# EAGLE design Power PCB (EAGLE 6.5.0)
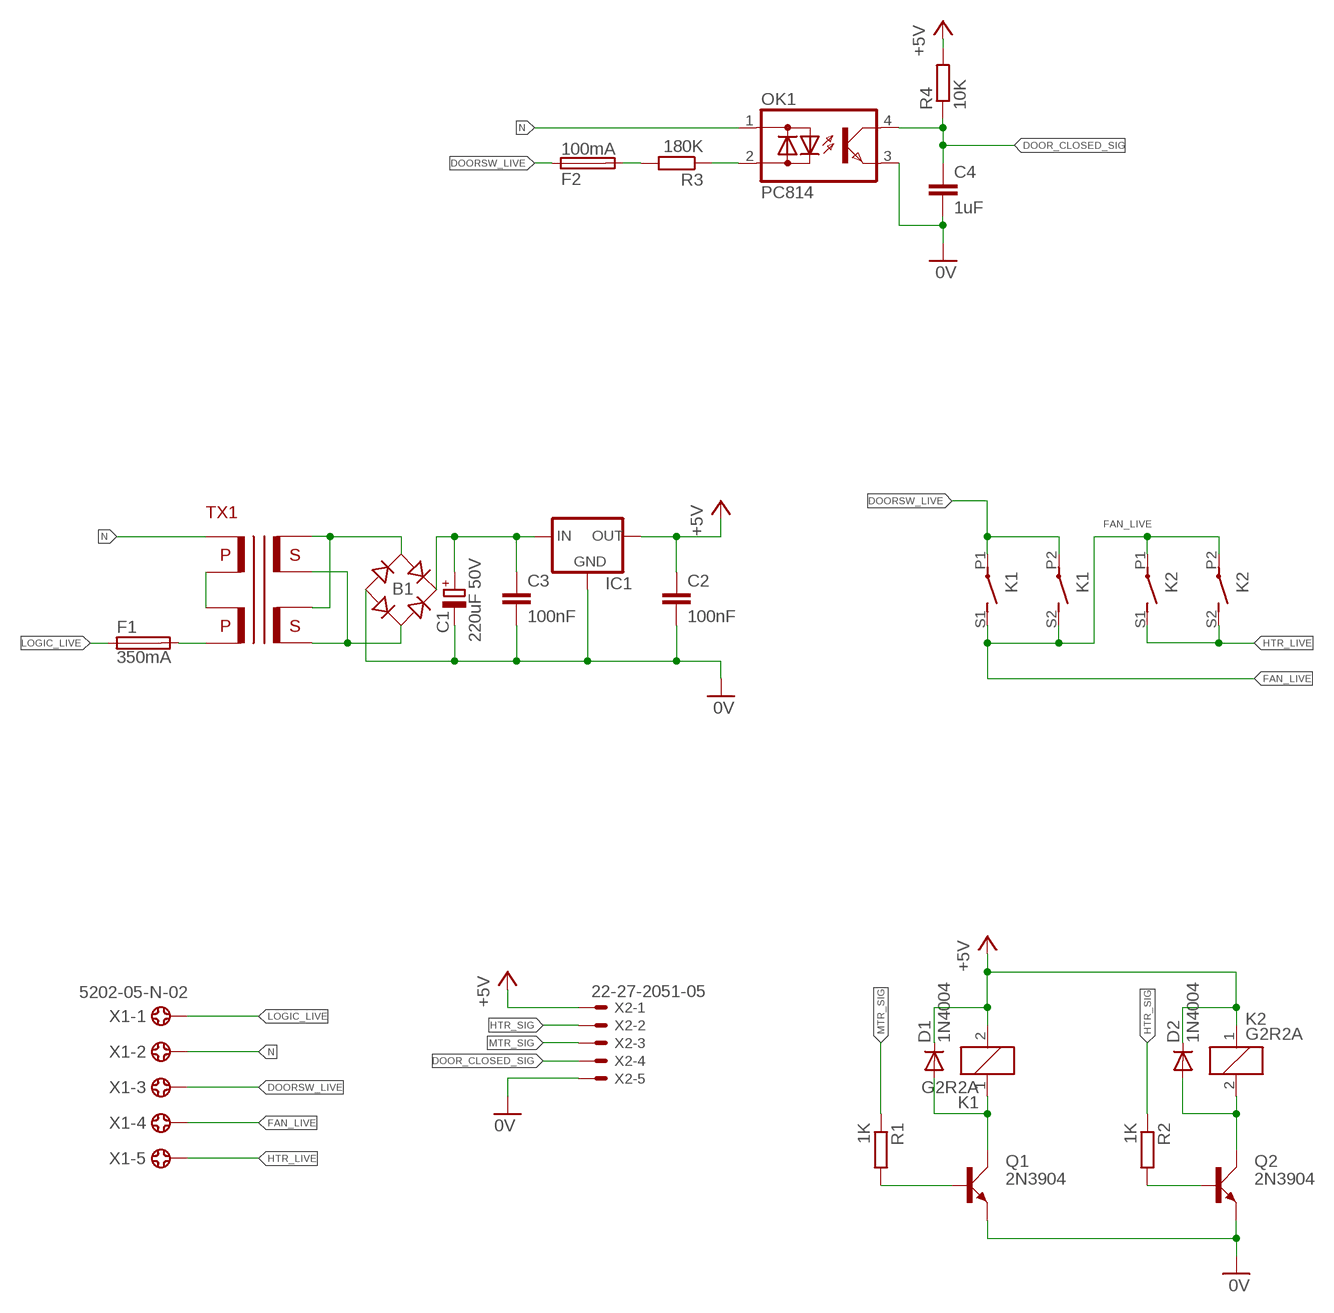
[diagram p0: schematic, sheet 1]

## Parts
B1  RECTIFIER-RB1A  [RB1A]
C1  220uF 50V  CPOL-EUE3.5-8  [E3,5-8]
C2  100nF  C-EU025-025X050  [C025-025X050]
C3  100nF  C-EU025-025X050  [C025-025X050]
C4  1uF  C-EU025-025X050  [C025-025X050]
D1  1N4004  [DO41-10]
D2  1N4004  [DO41-10]
F1  350mA  SH25  [SH25]
F2  100mA  SH25  [SH25]
IC1  V_REG_78XX-TO-220  [TO-220-ALT]
K1  G2R2A  [G2R2A]
K2  G2R2A  [G2R2A]
OK1  PC814  [DIL04]
Q1  2N3904  [TO92D]
Q2  2N3904  [TO92D]
R1  1K  R-EU_0207/10  [0207/10]
R2  1K  R-EU_0207/10  [0207/10]
R3  180K  R-EU_0613/5V  [P0613V]
R4  10K  R-EU_0207/10  [0207/10]
TX1  RS504-397  [RS504-397]
X1  5202-05-N-02  [5202-05-N-02]
X2  22-27-2051-05  [6410-05]

## Nets
0V: B1.- C1.- C2.2 C3.2 C4.2 IC1.GND OK1.3(E) Q1.E Q2.E X2.5
+5V: C2.1 D1.C D2.C IC1.OUT K1.2 K2.1 R4.2 X2.1
DOOR_CLOSED_SIG: C4.1 OK1.4(C) R4.1 X2.4
DOORSW_LIVE: F2.1 K1.P1(2:P) K1.P2(3:P) X1.3
FAN_LIVE: K1.S1(2:S) K1.S2(3:S) K2.P1(2:P) K2.P2(3:P) X1.4
HTR_LIVE: K2.S1(2:S) K2.S2(3:S) X1.5
HTR_SIG: R2.1 X2.2
LOGIC_LIVE: F1.1 X1.1
MTR_SIG: R1.1 X2.3
N: OK1.1(AC1) TX1.115V1 X1.2
N$1: OK1.2(AC2) R3.1
N$2: F2.2 R3.2
N$3: F1.2 TX1.0V2
N$5 [mains]: TX1.0V1 TX1.115V2
N$6: B1.AC2 TX1.12V1_0 TX1.12V2_0
N$7: B1.AC1 TX1.12V1 TX1.12V2
N$8: B1.+ C1.+ C3.1 IC1.IN
N$9: D2.A K2.2 Q2.C
N$11: D1.A K1.1 Q1.C
N$15: Q1.B R1.2
N$16: Q2.B R2.2

## Library data of the parts
B1 = rectifier:RECTIFIER-: Rectifier
C1 = rcl:CPOL-EU: POLARIZED CAPACITOR, European symbol
C2-C4 = rcl:C-EU: CAPACITOR, European symbol
D1 D2 = diode:1N4004: DIODE general purpose rectifier, 1 A
F1 F2 = fuse:SH25: FUSE HOLDER grid 25 mm, OGN0031 8211, Schurter (Buerklin); MF: SCHURTER; MPN: 0031.8211; OC_FARNELL: 1162741; OC_NEWARK: 96B9380
IC1 = SparkFun:V_REG_78XX: Voltage Regulator Standard 7805 5V regulator. IGO (Input Ground Output). Spark Fun Electronics SKU : COM-00107
K1 K2 = relay:G2R2A: RELAY 2 x norm. open, Omron; MPN: G2R-2A-DC24; OC_FARNELL: 6985269; OC_NEWARK: 36M5257
OK1 = optocoupler:PC814: SHARP OPTO COUPLER; OC_FARNELL: 9707662; OC_NEWARK: unknown
Q1 Q2 = transistor-small-signal:2N3904: NPN TRANSISTOR
R1-R4 = rcl:R-EU_: RESISTOR, European symbol
TX1 = Duncs Transformers:RS504-397
X1 = con-ebyelectro:5202-05-N-02: Barrier Blocks Sreies 5202 Source: http://www.ebyelectro.com/PDF/5202-XX-N-02.pdf; OC_FARNELL: unknown; OC_NEWARK: unknown
X2 = con-molex:22-?-05: CONNECTOR wire to board 2.54 mm (.1 inch) pitch header; OC_FARNELL: unknown; OC_NEWARK: unknown

## Net classes
1 mains: width 0.813 mm, clearance 1.524 mm

## Board
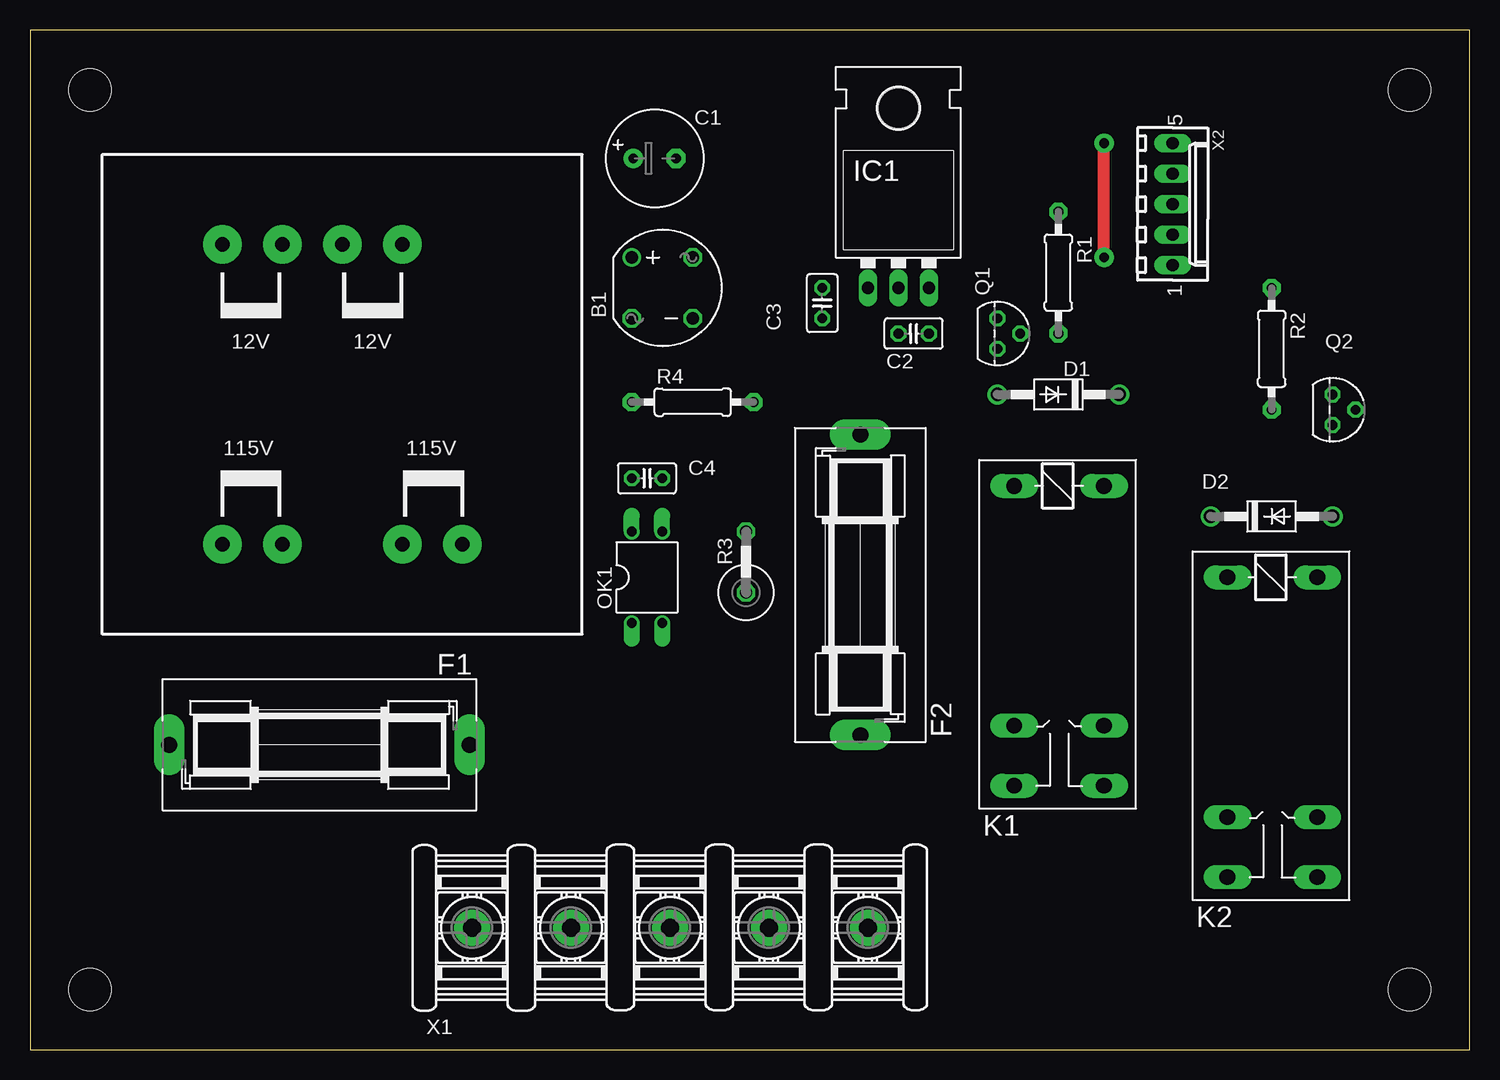
[diagram p1: board, top side]
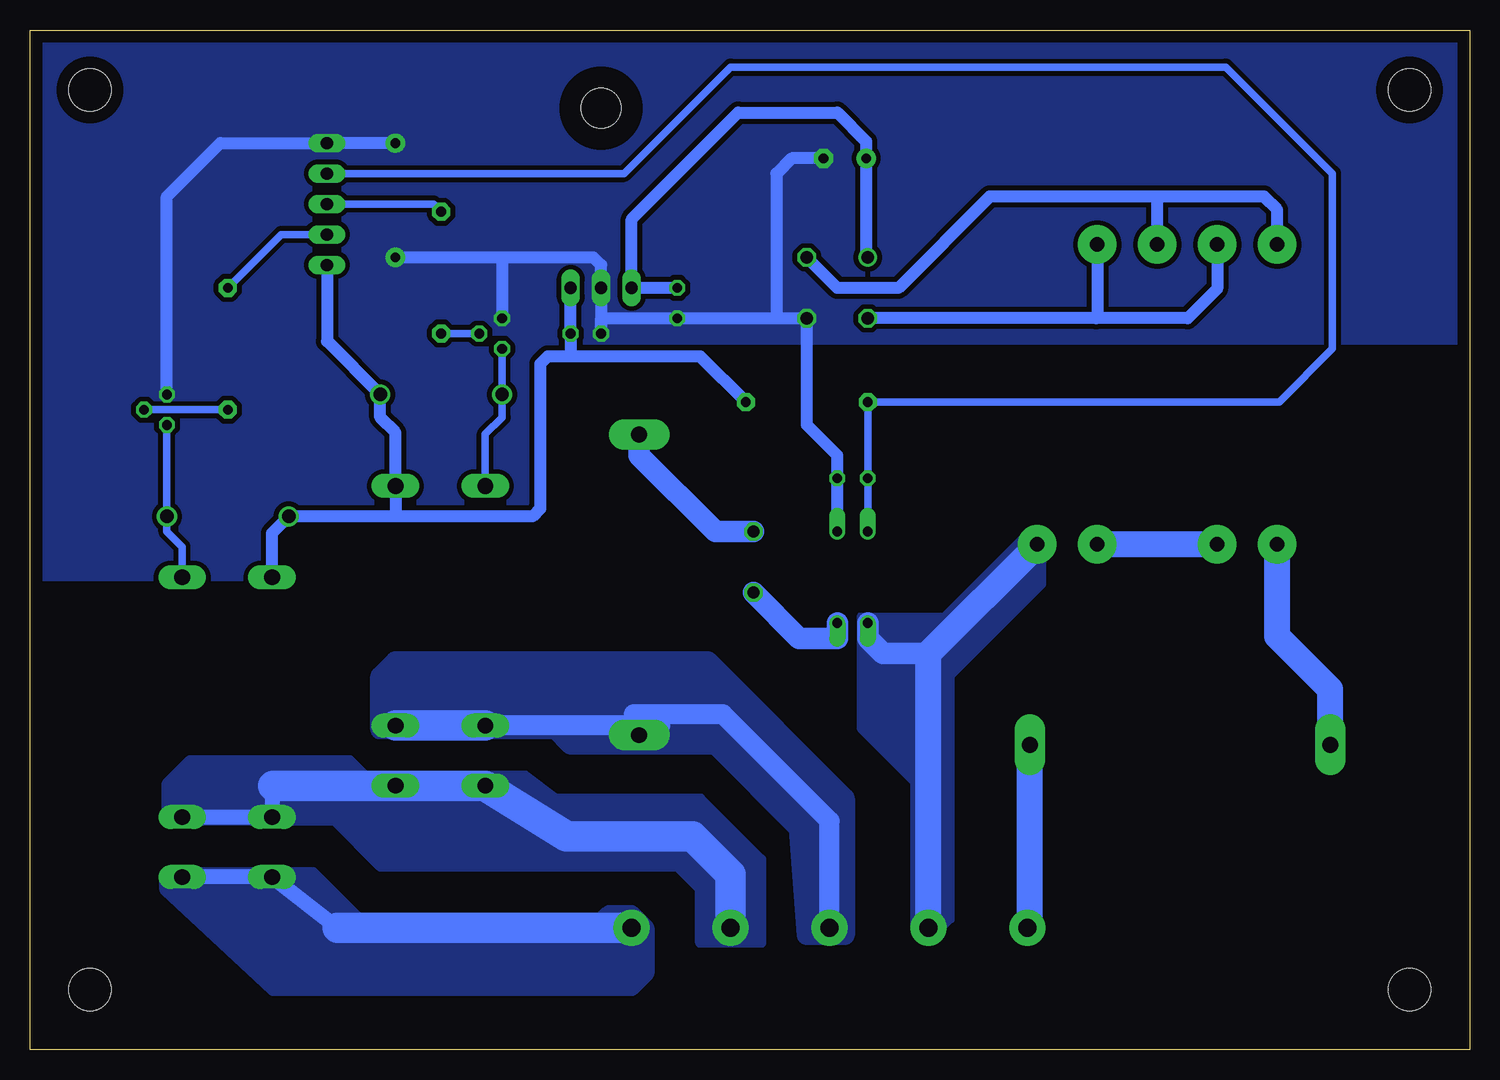
[diagram p2: board, bottom side, seen from below]

Size 120 x 85 mm. Coordinates in mm from the lower left corner, seen from the top.
Outline: 0,0 120,0 120,85 0,85 0,0
Copper layers (1*16): Top 0.035mm / dielectric 1.5mm / Bottom 0.035mm
Design rules "default": minimum track width 10mil, minimum drill 24mil, track to track 8mil, track to pad 8mil, pad to pad 8mil, via to via 8mil, smd to smd 8mil, copper to edge 40mil, drill to drill 8mil, minimum pad ring 10mil, minimum via ring 8mil, stop-mask expansion 4mil, vias tented up to drill 0mil, thermal gap 10mil
Holes 3.5 mm at 5,80 115,80 5,5 115,5

### Footprints (pad centres in the part's own frame; a part is rotated, then mirrored left to right if it is on the bottom)
RB1A = drill 1.016: + -2.54,2.54 | drill 1.016 octagon: - 2.54,-2.54; AC1 2.54,2.54; AC2 -2.54,-2.54
E3,5-8 = drill 0.813 pad 1.6: + -1.778,0 | drill 0.813 pad 1.6 octagon: - 1.778,0
C025-025X050 = drill 0.813 octagon: 1 -1.27,0; 2 1.27,0
DO41-10 = drill 1.118: A 5.08,0; C -5.08,0
SH25 = drill 1.321 pad 2.54 long: 1 -12.522,0; 2 12.522,0
TO-220-ALT = drill 1.016 long: GND 0,-3.81; IN -2.54,-3.81; OUT 2.54,-3.81 | hole 3.302: 0,11.176
G2R2A = drill 1.321 long: 1 -2.54,-3.683; 2 -2.54,3.81; P1 17.45,3.81; P2 17.45,-3.683; S1 22.454,3.81; S2 22.454,-3.683
DIL04 = drill 0.813 offset: 1 -1.27,-3.81; 2 1.27,-3.81; 3 1.27,3.81; 4 -1.27,3.81
TO92D = drill 0.813 octagon: B 0,1.905; C 1.27,0; E -1.27,0
0207/10 = drill 0.813 pad 1.5 octagon: 1 -5.08,0; 2 5.08,0
P0613V = drill 1.016 octagon: 1 -2.54,0; 2 2.54,0
RS504-397 = drill 1.2 pad 3.2: 0V1 -5,12.5; 0V2 10,12.5; 12V1 0,-12.5; 12V1_0 -5,-12.5; 12V2 10,-12.5; 12V2_0 5,-12.5; 115V1 -10,12.5; 115V2 5,12.5
5202-05-N-02 = drill 1.5 pad 3: 1 -16.5,0; 2 -8.25,0; 3 0,0; 4 8.25,0; 5 16.5,0
6410-05 = drill 1.016 long: 1 5.08,0; 2 2.54,0; 3 0,0; 4 -2.54,0; 5 -5.08,0

### Placement (x,y rotation side)
B1  52.7,63.5 0 top
C1  52.07,74.3 0 top
C2  73.66,59.69 180 top
C3  66.04,62.23 270 top
C4  51.44,47.62 0 top
D1  85.72,54.61 180 top
D2  103.5,44.45 0 top
F1  24.13,25.4 180 top
F2  69.22,38.73 90 top
IC1  72.39,67.31 0 top
K1  85.72,44.45 270 top
K2  103.5,36.83 270 top
OK1  51.44,39.37 0 top
Q1  80.64,59.69 270 top
Q2  108.58,53.34 270 top
R1  85.72,64.77 270 top
R2  103.5,58.42 270 top
R3  59.69,40.64 90 top
R4  55.24,53.98 0 top
TX1  26.04,54.61 180 top
X1  53.34,10.16 0 top
X2  95.25,70.48 270 top

### Tracks (layer width: path | path; a pad name or v marks a point on that pad's centre or on a via)
0V  (via drill 0.8 pad 1.6)
  Top 1.016: v89.53,66.04 v89.53,75.56
  Bottom 1.016: 80.64,66.04 Q1.E | C1.- 56.52,74.3 57.78,73.03 57.78,60.96 | 57.78,60.96 B1.- 55.24,52.07 52.7,49.53 C4.2 OK1.3 | 57.78,60.96 C3.2 72.39,60.96 C2.2 IC1.GND 72.39,65.41 73.03,66.04 80.64,66.04 | 80.64,66.04 v89.53,66.04 | v89.53,75.56 X2.5 104.14,75.56 108.58,71.12 Q2.E
  pour Bottom (isolate 0.406, no thermals): 120.65,85.72 -0.64,85.72 -0.64,59.05 75.56,59.05 77.47,57.15 77.47,45.72 78.11,45.09 93.34,45.09 99.06,39.37 120.65,39.37
+5V
  Bottom 1.016: K2.1 99.82,43.05 D2.C 89.53,44.45 | IC1.OUT C2.1 74.93,57.78 | 89.53,44.45 78.11,44.45 77.47,45.09 77.47,57.15 76.83,57.78 74.93,57.78 | X2.1 95.25,59.05 D1.C 90.81,52.7 89.53,51.44 K1.2 89.53,44.45 | R4.2 64.14,57.78 74.93,57.78
DOOR_CLOSED_SIG
  Bottom 0.61: OK1.4 C4.1 R4.1 15.88,53.98 11.43,58.42 11.43,73.03 20.32,81.92 61.59,81.92 70.48,73.03 X2.4
DOORSW_LIVE
  Bottom 1.676: X1.3 53.34,19.05 62.23,27.94 69.67,27.94 F2.1 67.46,27 K1.P2
  Bottom 2.54: K1.P2 K1.P1
  pour Bottom (no thermals): 52.07,9.53 55.24,9.53 55.88,18.41 62.87,25.4 74.93,25.4 76.2,26.67 90.81,26.67 90.81,31.11 89.53,32.38 63.5,32.38 52.07,20.95
FAN_LIVE
  Bottom 1.27: K2.P1 K2.P2 99.75,22
  Bottom 2.54: 99.75,22 K1.S1 K1.S2 75.29,17.78 64.77,17.78 61.59,14.6 X1.4
  pour Bottom (no thermals): 108.58,19.05 108.58,22.23 106.68,24.13 93.34,24.13 92.08,22.86 78.74,22.86 76.2,20.95 64.14,20.95 59.05,15.88 59.05,8.89 64.14,8.89 64.14,13.34 66.04,15.24 90.81,15.24 94.61,19.05
HTR_LIVE
  Bottom 1.27: K2.S1 K2.S2 94.34,10.16
  Bottom 2.54: 94.34,10.16 X1.5
  pour Bottom (no thermals): 108.58,14.61 96.52,14.61 92.71,10.79 72.39,10.79 71.75,11.43 69.85,11.43 68.58,10.16 68.58,6.35 69.85,5.08 99.69,5.08 108.58,13.34
HTR_SIG
  Bottom 0.61: X2.2 99.06,67.94 R2.1
LOGIC_LIVE
  Bottom 1.676: X1.1 36.65,10.35
  Bottom 2.159: 36.65,10.35 F1.1
MTR_SIG
  Bottom 0.61: R1.1 86.36,70.48 X2.3
N
  Bottom 1.778: 45.09,33.02 48.9,33.02 50.16,34.29 OK1.1 | 35.99,42.11 TX1.115V1
  Bottom 2.159: X1.2 45.09,33.02 35.99,42.11
  pour Bottom (no thermals): 50.8,36.2 43.81,36.2 36.83,43.18 35.56,43.18 35.56,38.73 43.18,31.11 43.18,10.79 44.45,9.53 45.72,9.53 46.35,10.16 46.35,22.23 50.8,26.67
N$1
  Bottom 1.778: OK1.2 52.7,34.29 55.88,34.29 R3.1
N$2
  Bottom 1.778: R3.2 62.87,43.18 69.22,49.53 69.22,50.8 F2.2
N$3
  Bottom 2.159: F1.2 11.61,30.02 16.04,34.45 TX1.0V2
N$5
  Bottom 2.159: TX1.115V2 TX1.0V1
N$6
  Bottom 1.016: 31.11,60.96 23.5,60.96 21.04,63.42 TX1.12V2_0 | 31.11,60.96 B1.AC2 | TX1.12V1_0 31.04,61.04 31.11,60.96
N$7
  Bottom 1.016: TX1.12V2 16.04,70.01 17.14,71.12 26.04,71.12 | 26.04,71.12 40.01,71.12 47.62,63.5 52.7,63.5 B1.AC1 | TX1.12V1 26.04,71.12
N$8
  Bottom 1.016: B1.+ 50.29,66.17 C1.+ 50.29,75.69 52.7,78.11 60.96,78.11 69.85,69.22 IC1.IN C3.1
N$9
  Bottom 0.61: K2.2 107.31,41.91 108.58,43.18 D2.A Q2.C
N$11
  Bottom 0.61: K1.1 82.04,51.31 80.64,52.7 D1.A Q1.C
N$15
  Bottom 0.61: Q1.B R1.2
N$16
  Bottom 0.61: Q2.B R2.2